# Altium schematic sheet pcuETH.SchDoc
size A3
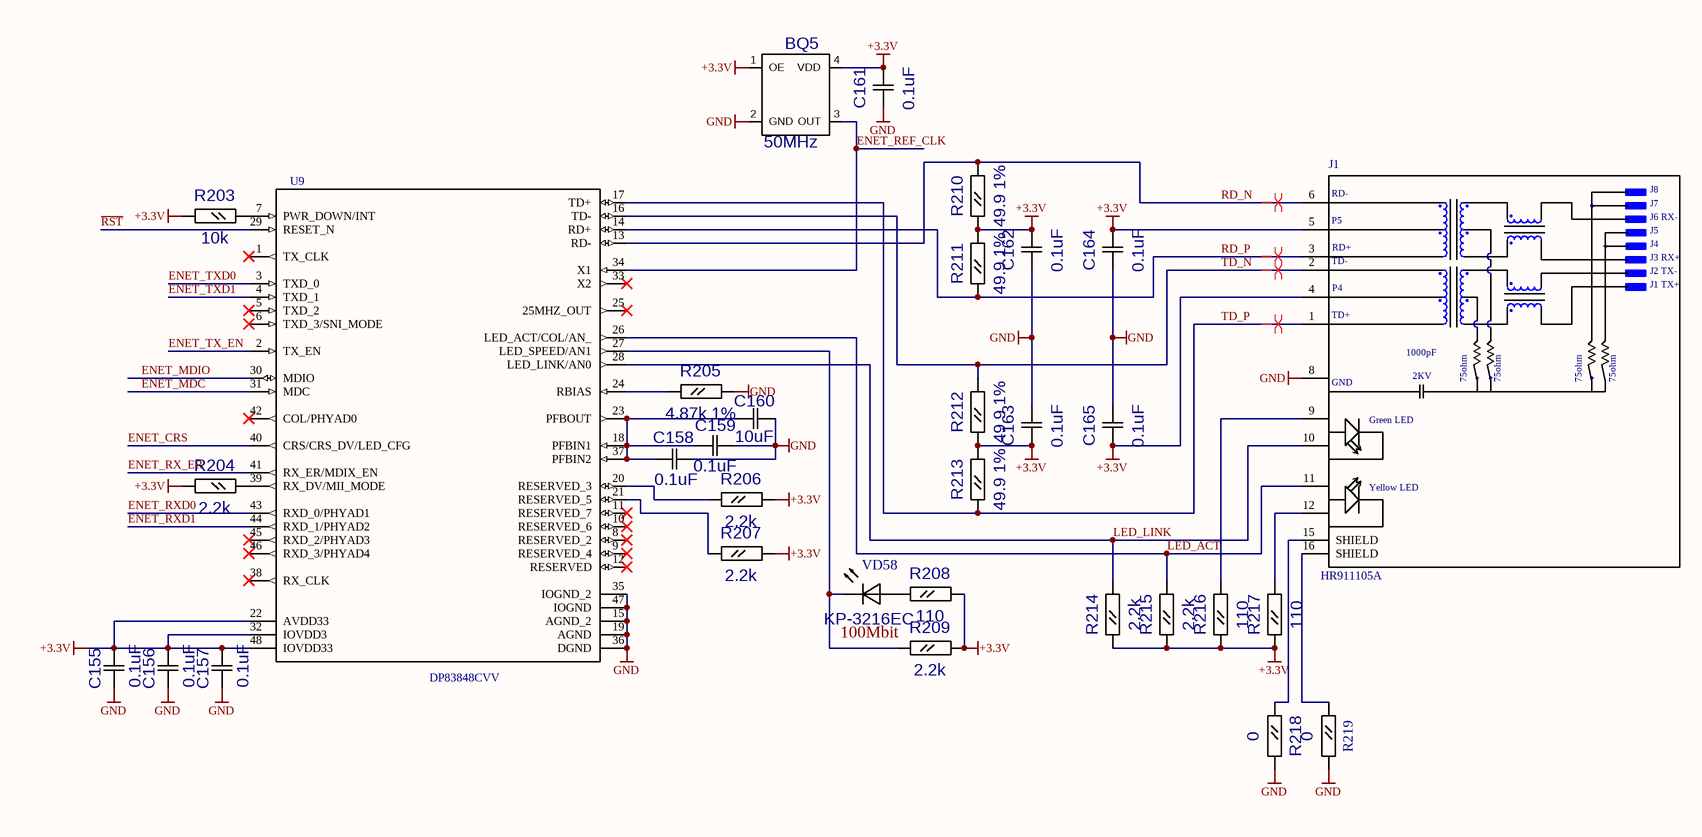
[diagram p0: pcuETH.SchDoc]

## Parts
BQ5  50MHz  [5032]
C155  value 0.1uF  [C0805]  (hidden comment: C0805)
C156  value 0.1uF  [C0805]  (hidden comment: C0805)
C157  value 0.1uF  [C0805]  (hidden comment: C0805)
C158  value 0.1uF  [C0805]  (hidden comment: C0805)
C159  value 0.1uF  [C0805]  (hidden comment: C0805)
C160  value 10uF  [C1206]  (hidden comment: C1206)
C161  value 0.1uF  [C0805]  (hidden comment: C0805)
C162  value 0.1uF  [C0805]  (hidden comment: C0805)
C163  value 0.1uF  [C0805]  (hidden comment: C0805)
C164  value 0.1uF  [C0805]  (hidden comment: C0805)
C165  value 0.1uF  [C0805]  (hidden comment: C0805)
J1  HR911105A  [HANRUN_HR911105A]
R203  value 10k  [R0805]  (hidden comment: R0805)
R204  value 2.2k  [R0805]  (hidden comment: R0805)
R205  value 4.87k 1%  [R0805]  (hidden comment: R0805)
R206  value 2.2k  [R0805]  (hidden comment: R0805)
R207  value 2.2k  [R0805]  (hidden comment: R0805)
R208  value 110  [R0805]  (hidden comment: R0805)
R209  value 2.2k  [R0805]  (hidden comment: R0805)
R210  value 49.9 1%  [R0805]  (hidden comment: R0805)
R211  value 49.9 1%  [R0805]  (hidden comment: R0805)
R212  value 49.9 1%  [R0805]  (hidden comment: R0805)
R213  value 49.9 1%  [R0805]  (hidden comment: R0805)
R214  value 2.2k  [R0805]  (hidden comment: R0805)
R215  value 2.2k  [R0805]  (hidden comment: R0805)
R216  value 110  [R0805]  (hidden comment: R0805)
R217  value 110  [R0805]  (hidden comment: R0805)
R218  value 0  [R0805]  (hidden comment: R0805)
R219  value 0  [R0805]  (hidden comment: R0805)
U9  DP83848CVV  [QFP48]
VD58  KP-3216EC  [KP-3216 Hole]

## Nets
+3.3V: BQ5.1(OE) BQ5.4(VDD) C155.2 C156.2 C157.2 C161.2 C162.2 C163.1 C164.2 C165.1 J1.4(P4) J1.5(P5) R203.1 R204.1 R206.1 R207.1 R208.1 R209.1 R210.2 R211.1 R212.2 R213.1 R214.2 R215.2 R216.2 R217.2 U9.22(AVDD33) U9.32(IOVDD3) U9.48(IOVDD33)
GND: BQ5.2(GND) C155.1 C156.1 C157.1 C158.2 C159.2 C160.2 C161.1 C162.1 C163.2 C164.1 C165.2 J1.8(GND) R205.1 R218.1 R219.1 U9.15(AGND_2) U9.19(AGND) U9.35(IOGND_2) U9.36(DGND) U9.47(IOGND)
ENET_CRS: U9.40(CRS/CRS_DV/LED_CFG)
ENET_MDC: U9.31(MDC)
ENET_MDIO: U9.30(MDIO)
ENET_REF_CLK: BQ5.3(OUT) U9.34(X1)
ENET_RX_ER: U9.41(RX_ER/MDIX_EN)
ENET_RXD0: U9.43(RXD_0/PHYAD1)
ENET_RXD1: U9.44(RXD_1/PHYAD2)
ENET_TX_EN: U9.2(TX_EN)
ENET_TXD0: U9.3(TXD_0)
ENET_TXD1: U9.4(TXD_1)
LED_ACT: J1.11(YA) R215.1 U9.26(LED_ACT/COL/AN_)
LED_LINK: J1.10(GC) R214.1 U9.28(LED_LINK/AN0)
~{RST}: U9.29(RESET_N)
RD_N: J1.6(RD-) R210.1 U9.13(RD-)
RD_P: J1.3(RD+) R211.2 U9.14(RD+)
TD_N: J1.2(TD-) R212.1 U9.16(TD-)
TD_P: J1.1(TD+) R213.2 U9.17(TD+)
NetC158_1: C158.1 C159.1 C160.1 U9.18(PFBIN1) U9.23(PFBOUT) U9.37(PFBIN2)
NetJ1_9: J1.9(GA) R216.1
NetJ1_12: J1.12(YC) R217.1
NetJ1_15: J1.15(SHIELD) R218.2
NetJ1_16: J1.16(SHIELD) R219.2
NetR203_2: R203.2 U9.7(PWR_DOWN/INT)
NetR204_2: R204.2 U9.39(RX_DV/MII_MODE)
NetR205_2: R205.2 U9.24(RBIAS)
NetR206_2: R206.2 U9.20(RESERVED_3)
NetR207_2: R207.2 U9.21(RESERVED_5)
NetR208_2: R208.2 VD58.1
NetR209_2: R209.2 U9.27(LED_SPEED/AN1) VD58.2

Not connected (* = marked no-connect by the designer): U9 1(TX_CLK)* 5(TXD_2)* 6(TXD_3/SNI_MODE)* 8(RESERVED_2)* 9(RESERVED_4)* 10(RESERVED_6)* 11(RESERVED_7)* 12(RESERVED)* 25(25MHZ_OUT)* 33(X2)* 38(RX_CLK)* 42(COL/PHYAD0)* 45(RXD_2/PHYAD3)* 46(RXD_3/PHYAD4)*

## Layout directives
differential pair: RD_N, RD_P, TD_N, TD_P

## Notes on the sheet
- (near R209) 100Mbit
- (in symbol HR911105A) J8; J7; J6 RX-; J5; J4; J3 RX+; J2 TX-; J1 TX+; 1000pF; 2KV; 75ohm; Green LED; Yellow LED

## Library data of the parts
BQ5 = OSC: Value: 50MHz
C155-C159 C161-C165 = C0805: RefDes2: {RefDes2}
C160 = C1206: RefDes2: {RefDes2}
J1 = HR911105A: DIP RJ45 Connector;; MF: HanRun; Availability: Unavailable; MP: HR911105A; Price: None; Package: None; Value: *
R203-R219 = R0805: RefDes2: {RefDes2}
U9 = DP83848CVV: PHYTER Commercial Temperature Single Port 10/100 Mb/s Ethernet Physical Layer Transceiver 48-LQFP 0 to 70; MF: Texas Instruments; MP: DP83848CVV/NOPB; Digi-Key_Part_Number: DP83848CVV/NOPB-ND; Digi-Key_Purchase_URL: https://www.digikey.com/product-detail/en/texas-instruments/DP83848CVV-NOPB/DP83848CVV-NOPB-ND/947542?WT.z_cid=ref_snapeda&utm_source=snapeda&utm_medium=aggregator&utm_campaign=buynow; Package: LQFP-48 Texas Instruments; Value: *
VD58 = KP-3216EC: RefDes2: {RefDes2}